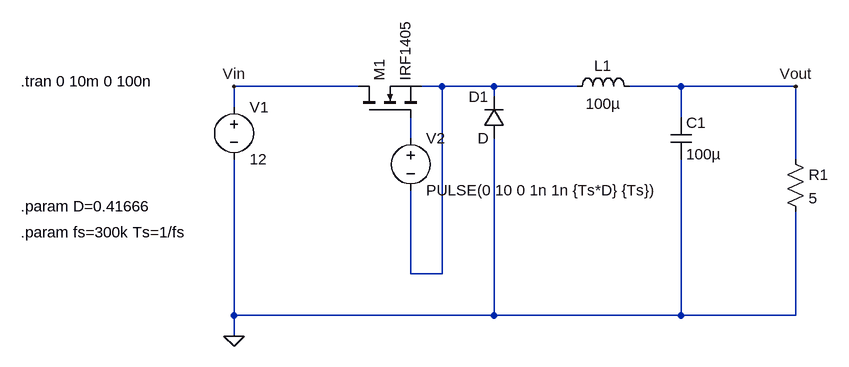
[diagram p0: schematic Convertor_Buck.asc]
Convertor_Buck.asc, the LTspice schematic file:
Version 4
SHEET 1 900 680
WIRE 160 112 -32 112
WIRE 288 112 256 112
WIRE 368 112 288 112
WIRE 496 112 368 112
WIRE 656 112 576 112
WIRE 832 112 656 112
WIRE 368 128 368 112
WIRE -32 144 -32 112
WIRE 656 160 656 112
WIRE 240 192 240 160
WIRE 832 224 832 112
WIRE 240 400 240 272
WIRE 288 400 288 112
WIRE 288 400 240 400
WIRE -32 464 -32 224
WIRE 368 464 368 192
WIRE 368 464 -32 464
WIRE 656 464 656 224
WIRE 656 464 368 464
WIRE 832 464 832 304
WIRE 832 464 656 464
WIRE -32 496 -32 464
FLAG -32 496 0
FLAG -32 112 Vin
FLAG 832 112 Vout
SYMBOL nmos 160 160 R270
SYMATTR InstName M1
SYMATTR Value IRF1405
SYMBOL diode 384 192 R180
WINDOW 0 24 64 Left 2
WINDOW 3 24 0 Left 2
SYMATTR InstName D1
SYMBOL ind 480 128 R270
WINDOW 0 32 56 VTop 2
WINDOW 3 5 56 VBottom 2
SYMATTR InstName L1
SYMATTR Value 100µ
SYMBOL cap 640 160 R0
SYMATTR InstName C1
SYMATTR Value 100µ
SYMBOL res 816 208 R0
SYMATTR InstName R1
SYMATTR Value 5
SYMBOL voltage -32 128 R0
WINDOW 123 0 0 Left 0
WINDOW 39 0 0 Left 0
SYMATTR InstName V1
SYMATTR Value 12
SYMBOL voltage 240 176 R0
WINDOW 123 0 0 Left 0
WINDOW 39 0 0 Left 0
SYMATTR InstName V2
SYMATTR Value PULSE(0 10 0 1n 1n {Ts*D} {Ts})
TEXT -360 104 Left 2 !.tran 0 10m 0 100n
TEXT -360 296 Left 2 !.param D=0.41666
TEXT -360 336 Left 2 !.param fs=300k Ts=1/fs

The netlist it stands for:
* Convertor_Buck.asc
M1 Vin N002 N001 N001 IRF1405
D1 0 N001 D
L1 N001 Vout 100µ
C1 Vout 0 100µ
R1 Vout 0 5
V1 Vin 0 12
V2 N002 N001 PULSE(0 10 0 1n 1n {Ts*D} {Ts})
.model D D
.lib standard.dio
.model NMOS NMOS
.model PMOS PMOS
.lib standard.mos
.tran 0 10m 0 100n
.param D=0.41666
.param fs=300k Ts=1/fs
.backanno
.end